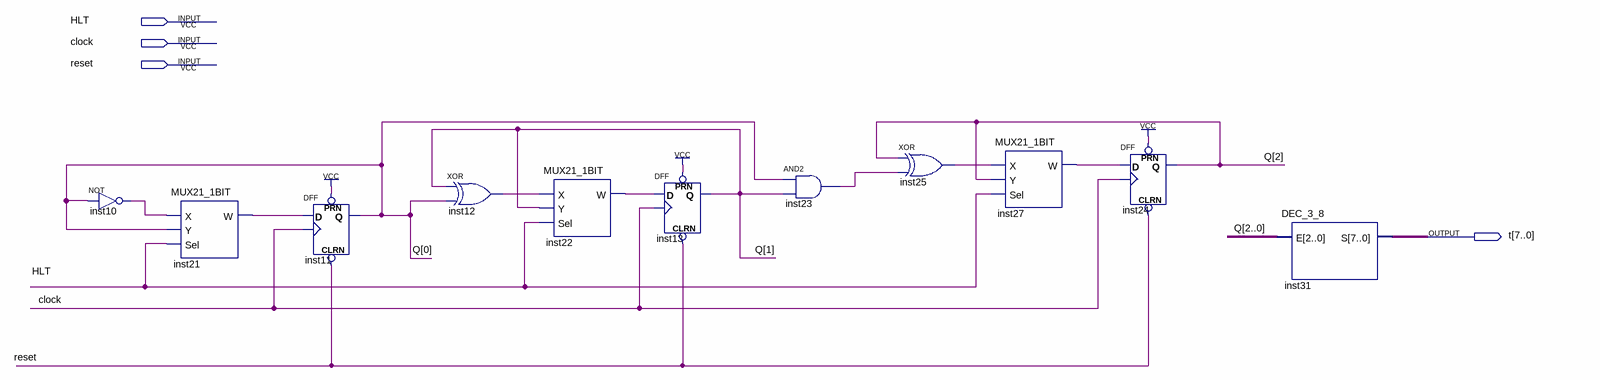
[diagram p0: schematic sheet]
// Quartus schematic TEMPORIZADOR.bdf as structural Verilog: 11 symbols, 4 pins
module TEMPORIZADOR (
  input  HLT,
  input  clock,
  input  reset,
  output [7:0] t
);

  wire inst10_out, inst12_out, inst21_w, inst22_w, inst23_out, inst25_out, inst27_w;
  wire [2:0] Q;

  not inst10 (inst10_out, Q[0]);
  MUX21_1BIT inst21 (.X(inst10_out), .Y(Q[0]), .Sel(HLT), .W(inst21_w));
  DFF inst11 (.CLRN(reset), .CLK(clock), .D(inst21_w), .PRN(1'b1), .Q(Q[0]));
  xor inst12 (inst12_out, Q[1], Q[0]);
  MUX21_1BIT inst22 (.X(inst12_out), .Y(Q[1]), .Sel(HLT), .W(inst22_w));
  DFF inst13 (.CLRN(reset), .CLK(clock), .D(inst22_w), .PRN(1'b1), .Q(Q[1]));
  and inst23 (inst23_out, Q[0], Q[1]);
  xor inst25 (inst25_out, Q[2], inst23_out);
  MUX21_1BIT inst27 (.X(inst25_out), .Y(Q[2]), .Sel(HLT), .W(inst27_w));
  DFF inst24 (.CLRN(reset), .CLK(clock), .D(inst27_w), .PRN(1'b1), .Q(Q[2]));
  DEC_3_8 inst31 (.E(Q), .S(t));
endmodule
